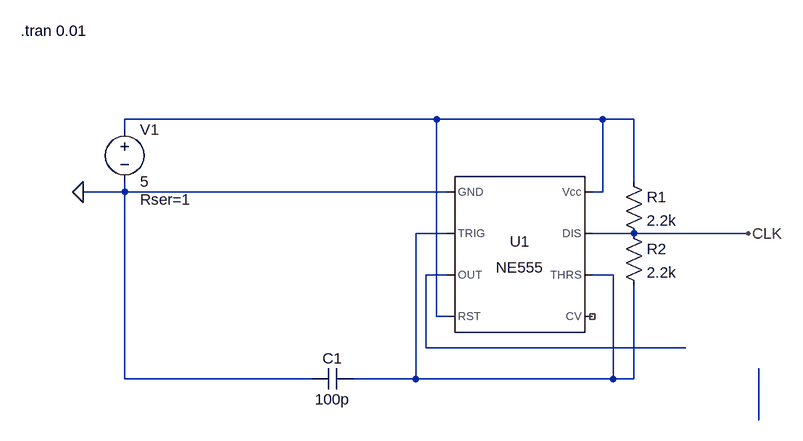
[diagram p0: schematic Draft1.asc]
Draft1.asc, the LTspice schematic file:
Version 4
SHEET 1 880 680
WIRE 80 32 -400 32
WIRE 336 32 80 32
WIRE 384 32 336 32
WIRE -400 48 -400 32
WIRE 384 128 384 32
WIRE -400 144 -400 128
WIRE -400 144 -464 144
WIRE 96 144 -400 144
WIRE 336 144 336 32
WIRE 336 144 320 144
WIRE 96 208 48 208
WIRE 384 208 320 208
WIRE 560 208 384 208
WIRE 96 272 64 272
WIRE 352 272 320 272
WIRE 80 336 80 32
WIRE 96 336 80 336
WIRE 64 384 64 272
WIRE 464 384 64 384
WIRE -400 432 -400 144
WIRE -112 432 -400 432
WIRE 48 432 48 208
WIRE 48 432 -48 432
WIRE 352 432 352 272
WIRE 352 432 48 432
WIRE 384 432 384 288
WIRE 384 432 352 432
WIRE 576 496 576 416
FLAG 560 208 CLK
FLAG -464 144 0
SYMBOL Misc\\NE555 208 240 R0
SYMATTR InstName U1
SYMBOL voltage -400 32 R0
WINDOW 123 0 0 Left 0
WINDOW 39 24 124 Left 2
SYMATTR InstName V1
SYMATTR Value 5
SYMATTR SpiceLine Rser=1
SYMBOL cap -48 416 R90
WINDOW 0 0 32 VBottom 2
WINDOW 3 32 32 VTop 2
SYMATTR InstName C1
SYMATTR Value 100p
SYMATTR SpiceLine V=25 Irms=0 Rser=0 Lser=0 mfg="Murata" pn="GRM0335C1E101JA01" type="C0G"
SYMBOL res 368 112 R0
SYMATTR InstName R1
SYMATTR Value 2.2k
SYMBOL res 368 192 R0
SYMATTR InstName R2
SYMATTR Value 2.2k
TEXT -560 -104 Left 2 !.tran 0.01

The netlist it stands for:
* Draft1.asc
XU1 0 N002 N003 N001 NC_01 N002 CLK N001 NE555  ; pins GND TRIG OUT RST CV THRS DIS Vcc
V1 N001 0 5 Rser=1
C1 N002 0 100p V=25 Irms=0 Rser=0 Lser=0 mfg="Murata" pn="GRM0335C1E101JA01" type="C0G"
R1 N001 CLK 2.2k
R2 CLK N002 2.2k
.tran 0.01
.lib NE555.sub
.backanno
.end